# Altium schematic sheet Jukebox.SchDoc
size B
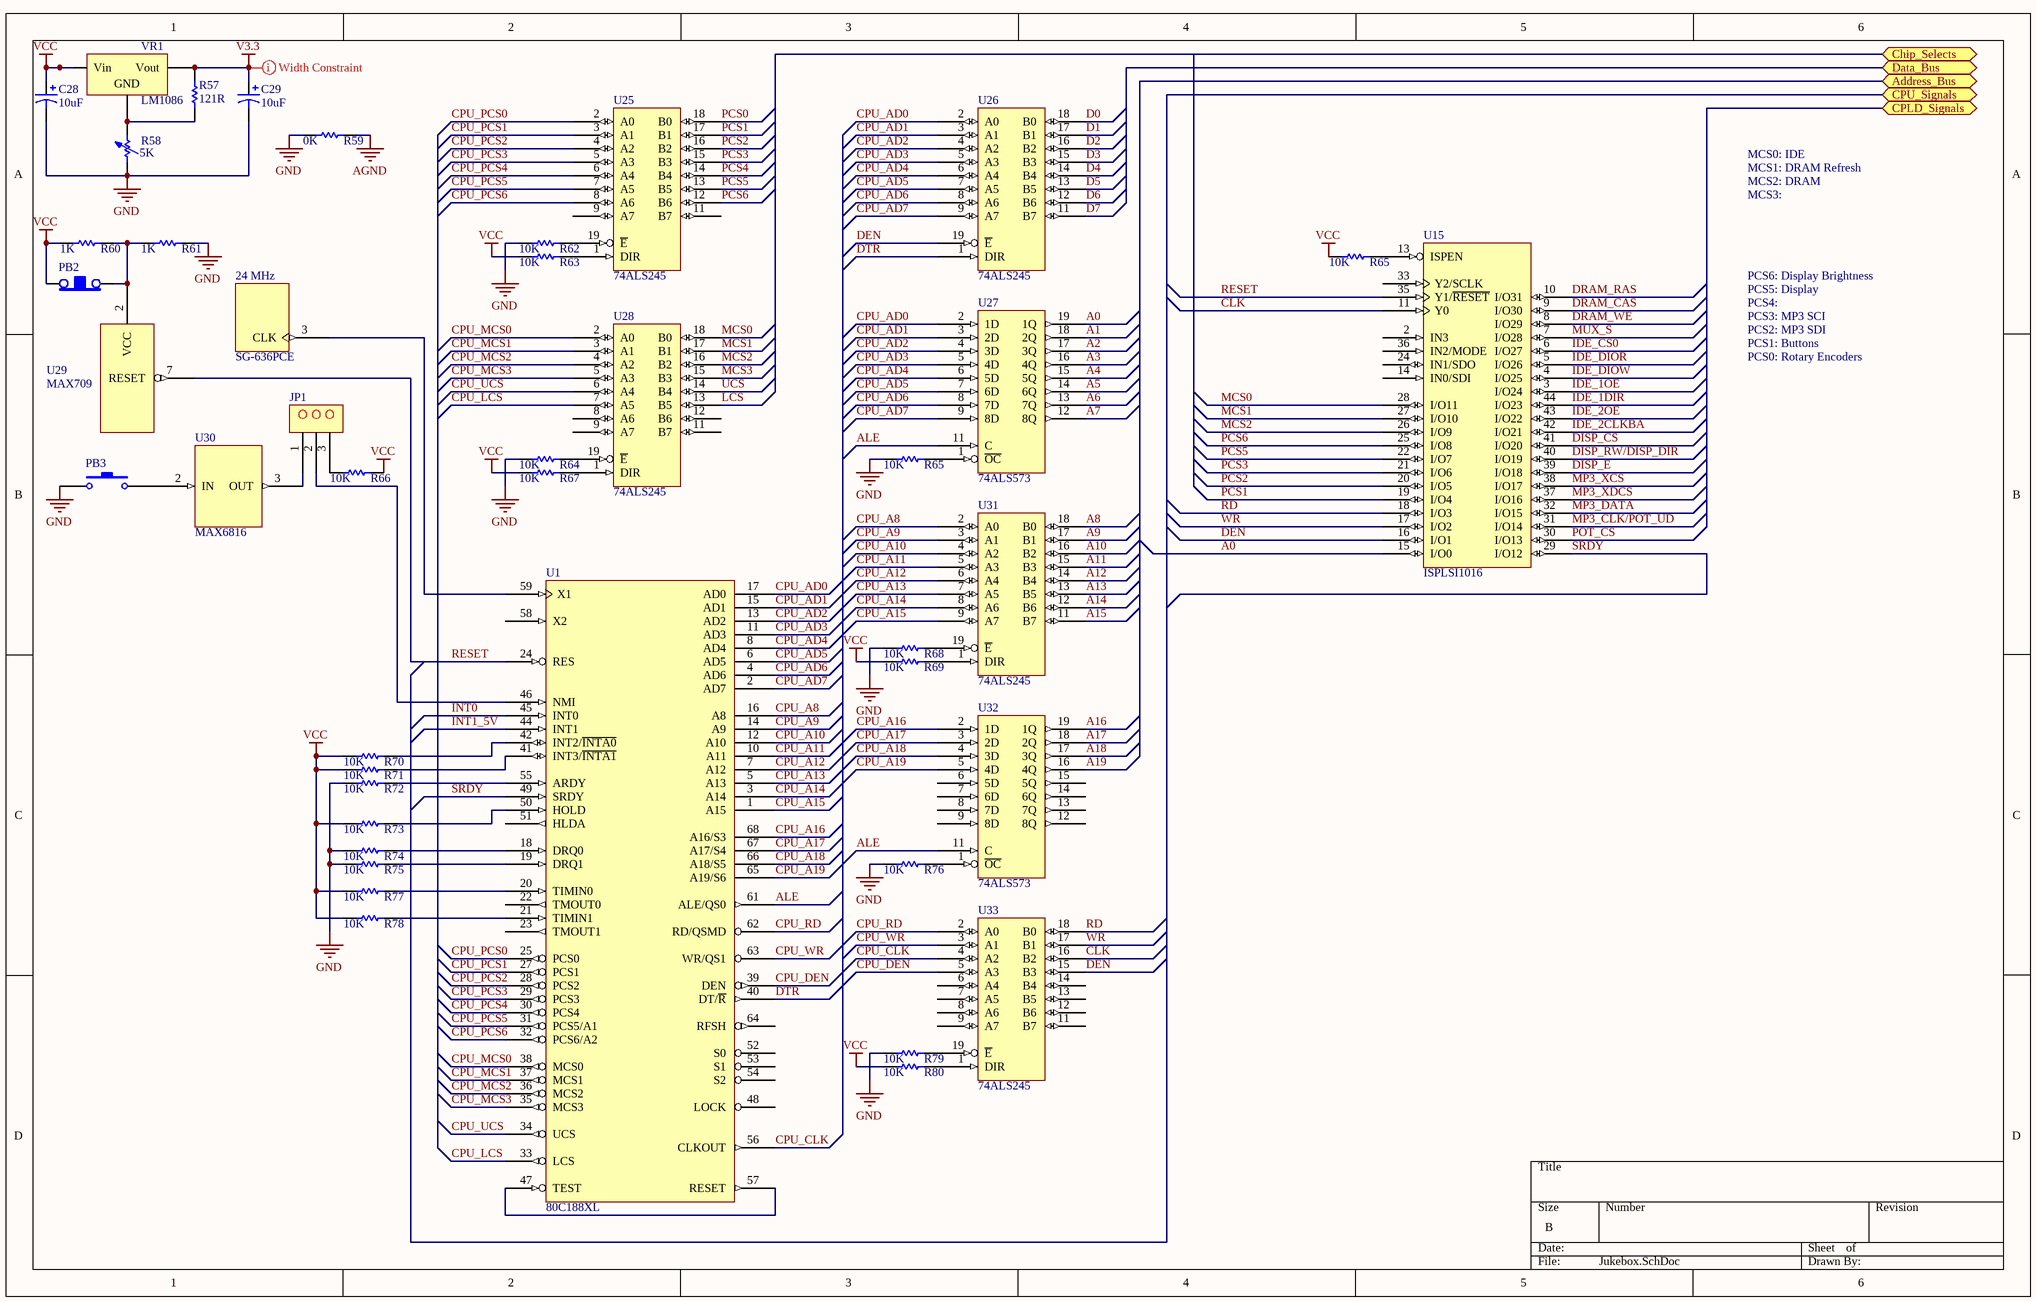
[diagram p0: Jukebox.SchDoc]

## Parts
(Parts that share a designator on the sheet are numbered #1, #2 ... from top to bottom, then left to right.)
24_MHz  SG-636PCE  [SG636PCE]
C28  value 10uF  [C0805]  (hidden comment: Cap Pol3)
C29  value 10uF  [C0805]  (hidden comment: Cap Pol3)
JP1  3P_JP  [3P_JP]  (value not drawn)
PB2  SWITCH-PBNC  [SIP2]  (value not drawn)
PB3  SW-PB  [PB_EG4791]  (value not drawn)
R57  value 121R  [AXIAL-0.3]  (hidden comment: Res1)
R58  value 5K  [AXIAL-0.7]  (hidden comment: Res Adj1)
R59  value 0K  [AXIAL-0.3]  (hidden comment: Res1)
R60  value 1K  [AXIAL-0.3]  (hidden comment: Res1)
R61  value 1K  [AXIAL-0.3]  (hidden comment: Res1)
R62  value 10K  [AXIAL-0.3]  (hidden comment: Res1)
R63  value 10K  [AXIAL-0.3]  (hidden comment: Res1)
R64  value 10K  [AXIAL-0.3]  (hidden comment: Res1)
R65#1  value 10K  [AXIAL-0.3]  (hidden comment: Res1)
R65#2  value 10K  [AXIAL-0.3]  (hidden comment: Res1)
R66  value 10K  [AXIAL-0.3]  (hidden comment: Res1)
R67  value 10K  [AXIAL-0.3]  (hidden comment: Res1)
R68  value 10K  [AXIAL-0.3]  (hidden comment: Res1)
R69  value 10K  [AXIAL-0.3]  (hidden comment: Res1)
R70  value 10K  [AXIAL-0.3]  (hidden comment: Res1)
R71  value 10K  [AXIAL-0.3]  (hidden comment: Res1)
R72  value 10K  [AXIAL-0.3]  (hidden comment: Res1)
R73  value 10K  [AXIAL-0.3]  (hidden comment: Res1)
R74  value 10K  [AXIAL-0.3]  (hidden comment: Res1)
R75  value 10K  [AXIAL-0.3]  (hidden comment: Res1)
R76  value 10K  [AXIAL-0.3]  (hidden comment: Res1)
R77  value 10K  [AXIAL-0.3]  (hidden comment: Res1)
R78  value 10K  [AXIAL-0.3]  (hidden comment: Res1)
R79  value 10K  [AXIAL-0.3]  (hidden comment: Res1)
R80  value 10K  [AXIAL-0.3]  (hidden comment: Res1)
U1  80C188XL  [PLCCS68I]
U15  ISPLSI1016  [TQFP44]
U25  74ALS245  [SSOP20]
U26  74ALS245  [SSOP20]
U27  74ALS573  [SSOP20]
U28  74ALS245  [SSOP20]
U29  MAX709  [UMAX8]
U30  MAX6816  [SOT-143]
U31  74ALS245  [SSOP20]
U32  74ALS573  [SSOP20]
U33  74ALS245  [SSOP20]
VR1  LM1086  [D2PAK_N]

## Ports
Address_Bus, Chip_Selects, CPLD_Signals, CPU_Signals, Data_Bus

## Nets
AGND: R59.1
GND: 24_MHz.2(GND) C28.2 C29.2 PB3.1 R58.1 R59.2 R61.1 R62.2 R64.2 R65#2.2 R68.2 R72.2 R74.2 R75.2 R76.2 R79.2 U1.26(GND) U1.60(GND) U15.1(GND) U15.23(GND) U25.10(GND) U26.10(GND) U27.10(GND) U28.10(GND) U29.3(GND) U30.1(GND) U31.10(GND) U32.10(GND) U33.10(GND)
V3.3: C29.1 R57.2 VR1.3(Vout)
VCC: 24_MHz.4(VCC) C28.1 PB2.1 R60.1 R63.2 R65#1.2 R66.1 R67.2 R69.2 R70.2 R71.2 R73.2 R77.2 R78.2 R80.2 U1.9(VCC) U1.43(VCC) U15.12(VCC) U15.34(VCC) U25.20(VCC) U26.20(VCC) U27.20(VCC) U28.20(VCC) U30.4(VCC) U31.20(VCC) U32.20(VCC) U33.20(VCC) VR1.1(Vin)
A0: U15.15(I/O0) U27.19(1Q)
A1: U27.18(2Q)
A2: U27.17(3Q)
A3: U27.16(4Q)
A4: U27.15(5Q)
A5: U27.14(6Q)
A6: U27.13(7Q)
A7: U27.12(8Q)
A8: U31.18(B0)
A9: U31.17(B1)
A10: U31.16(B2)
A11: U31.15(B3)
A12: U31.14(B4)
A13: U31.13(B5)
A14: U31.12(B6)
A15: U31.11(B7)
A16: U32.19(1Q)
A17: U32.18(2Q)
A18: U32.17(3Q)
A19: U32.16(4Q)
ALE: U1.61(ALE/QS0) U27.11(C) U32.11(C)
CLK: U15.11(Y0) U33.16(B2)
CPU_A8: U1.16(A8) U31.2(A0)
CPU_A9: U1.14(A9) U31.3(A1)
CPU_A10: U1.12(A10) U31.4(A2)
CPU_A11: U1.10(A11) U31.5(A3)
CPU_A12: U1.7(A12) U31.6(A4)
CPU_A13: U1.5(A13) U31.7(A5)
CPU_A14: U1.3(A14) U31.8(A6)
CPU_A15: U1.1(A15) U31.9(A7)
CPU_A16: U1.68(A16/S3) U32.2(1D)
CPU_A17: U1.67(A17/S4) U32.3(2D)
CPU_A18: U1.66(A18/S5) U32.4(3D)
CPU_A19: U1.65(A19/S6) U32.5(4D)
CPU_AD0: U1.17(AD0) U26.2(A0) U27.2(1D)
CPU_AD1: U1.15(AD1) U26.3(A1) U27.3(2D)
CPU_AD2: U1.13(AD2) U26.4(A2) U27.4(3D)
CPU_AD3: U1.11(AD3) U26.5(A3) U27.5(4D)
CPU_AD4: U1.8(AD4) U26.6(A4) U27.6(5D)
CPU_AD5: U1.6(AD5) U26.7(A5) U27.7(6D)
CPU_AD6: U1.4(AD6) U26.8(A6) U27.8(7D)
CPU_AD7: U1.2(AD7) U26.9(A7) U27.9(8D)
CPU_CLK: U1.56(CLKOUT) U33.4(A2)
CPU_DEN: U1.39(DEN) U33.5(A3)
CPU_LCS: U1.33(LCS) U28.7(A5)
CPU_MCS0: U1.38(MCS0) U28.2(A0)
CPU_MCS1: U1.37(MCS1) U28.3(A1)
CPU_MCS2: U1.36(MCS2) U28.4(A2)
CPU_MCS3: U1.35(MCS3) U28.5(A3)
CPU_PCS0: U1.25(PCS0) U25.2(A0)
CPU_PCS1: U1.27(PCS1) U25.3(A1)
CPU_PCS2: U1.28(PCS2) U25.4(A2)
CPU_PCS3: U1.29(PCS3) U25.5(A3)
CPU_PCS4: U1.30(PCS4) U25.6(A4)
CPU_PCS5: U1.31(PCS5/A1) U25.7(A5)
CPU_PCS6: U1.32(PCS6/A2) U25.8(A6)
CPU_RD: U1.62(RD/QSMD) U33.2(A0)
CPU_UCS: U1.34(UCS) U28.6(A4)
CPU_WR: U1.63(WR/QS1) U33.3(A1)
D0: U26.18(B0)
D1: U26.17(B1)
D2: U26.16(B2)
D3: U26.15(B3)
D4: U26.14(B4)
D5: U26.13(B5)
D6: U26.12(B6)
D7: U26.11(B7)
DEN: U15.16(I/O1) U26.19(~{E}) U33.15(B3)
DISP_CS: U15.41(I/O20)
DISP_E: U15.39(I/O18)
DISP_RW/DISP_DIR: U15.40(I/O19)
DRAM_CAS: U15.9(I/O30)
DRAM_RAS: U15.10(I/O31)
DRAM_WE: U15.8(I/O29)
DTR: U1.40(DT/~{R}) U26.1(DIR)
IDE_1DIR: U15.44(I/O23)
IDE_1OE: U15.3(I/O24)
IDE_2CLKBA: U15.42(I/O21)
IDE_2OE: U15.43(I/O22)
IDE_CS0: U15.6(I/O27)
IDE_DIOR: U15.5(I/O26)
IDE_DIOW: U15.4(I/O25)
INT0: U1.45(INT0)
INT1_5V: U1.44(INT1)
LCS: U28.13(B5)
MCS0: U15.28(I/O11) U28.18(B0)
MCS1: U15.27(I/O10) U28.17(B1)
MCS2: U15.26(I/O9) U28.16(B2)
MCS3: U28.15(B3)
MP3_CLK/POT_UD: U15.31(I/O14)
MP3_DATA: U15.32(I/O15)
MP3_XCS: U15.38(I/O17)
MP3_XDCS: U15.37(I/O16)
MUX_S: U15.7(I/O28)
PCS0: U25.18(B0)
PCS1: U15.19(I/O4) U25.17(B1)
PCS2: U15.20(I/O5) U25.16(B2)
PCS3: U15.21(I/O6) U25.15(B3)
PCS4: U25.14(B4)
PCS5: U15.22(I/O7) U25.13(B5)
PCS6: U15.25(I/O8) U25.12(B6)
POT_CS: U15.30(I/O13)
RD: U15.18(I/O3) U33.18(B0)
RESET: U1.24(RES) U15.35(Y1/~{RESET}) U29.7(RESET)
SRDY: U1.49(SRDY) U15.29(I/O12)
UCS: U28.14(B4)
WR: U15.17(I/O2) U33.17(B1)
Net24_MHz_3: 24_MHz.3(CLK) U1.59(X1)
NetJP1_1: JP1.1 U30.3(OUT)
NetJP1_2: JP1.2 U1.46(NMI)
NetJP1_3: JP1.3 R66.2
NetPB2_2: PB2.2 R60.2 R61.2 U29.2(VCC)
NetPB3_2: PB3.2 U30.2(IN)
NetR57_1: R57.1 R58.2 VR1.2(GND)
NetR62_1: R62.1 U25.19(~{E})
NetR63_1: R63.1 U25.1(DIR)
NetR64_1: R64.1 U28.19(~{E})
NetR65#1_1: R65#1.1 U15.13(ISPEN)
NetR65#2_1: R65#2.1 U27.1(~{OC})
NetR67_1: R67.1 U28.1(DIR)
NetR68_1: R68.1 U31.19(~{E})
NetR69_1: R69.1 U31.1(DIR)
NetR70_1: R70.1 U1.42(INT2/~{INTA0})
NetR71_1: R71.1 U1.41(INT3/~{INTA1})
NetR72_1: R72.1 U1.55(ARDY)
NetR73_1: R73.1 U1.50(HOLD)
NetR74_1: R74.1 U1.18(DRQ0)
NetR75_1: R75.1 U1.19(DRQ1)
NetR76_1: R76.1 U32.1(~{OC})
NetR77_1: R77.1 U1.20(TIMIN0)
NetR78_1: R78.1 U1.21(TIMIN1)
NetR79_1: R79.1 U33.19(~{E})
NetR80_1: R80.1 U33.1(DIR)
NetU1_47: U1.47(TEST) U1.57(RESET)

Not connected (* = marked no-connect by the designer): U1 22(TMOUT0) 23(TMOUT1) 48(LOCK) 51(HLDA) 52(S0) 53(S1) 54(S2) 58(X2) 64(RFSH); U15 2(IN3) 14(IN0/SDI) 24(IN1/SDO) 33(Y2/SCLK) 36(IN2/MODE); U25 9(A7) 11(B7); U28 8(A6) 9(A7) 11(B7) 12(B6); U32 6(5D) 7(6D) 8(7D) 9(8D) 12(8Q) 13(7Q) 14(6Q) 15(5Q); U33 6(A4) 7(A5) 8(A6) 9(A7) 11(B7) 12(B6) 13(B5) 14(B4)

## Layout directives
rule Width Constraint [Pref Width = 30mil    Min Width = 8mil    Max Width = 30mil]: V3.3

## Notes on the sheet
- MCS0: IDE
- MCS1: DRAM Refresh
- MCS3:
- MCS2: DRAM
- PCS6: Display Brightness
- PCS5: Display
- PCS4:
- PCS1: Buttons
- PCS0: Rotary Encoders
- PCS2: MP3 SDI
- PCS3: MP3 SCI

## Library data of the parts
24_MHz = OSC: TTL/CMOS Oscillator
C28 C29 = Cap Pol3: Polarized Capacitor (Surface Mount); Published: 8-Jun-2000; LatestRevisionDate: 29-May-2009; LatestRevisionNote: IPC-7351 Footprint Added.; PackageReference: C0805; Publisher: Altium Limited; PackageDescription: Chip Capacitor
PB2 = SWITCH-PBNC: Normally Closed Pushbutton Switch
PB3 = SW-PB: Switch; Published: 24-Mar-1999; LatestRevisionDate: 17-Jul-2002; LatestRevisionNote: Re-released for DXP Platform.; PackageReference: SPST-2; Publisher: Altium Limited; PackageDescription: Switch; 2 Leads
R57 R59-R64 R65#1 R65#2 R66-R80 = Res1: Resistor; Published: 8-Jun-2000; LatestRevisionDate: 17-Jul-2002; LatestRevisionNote: Re-released for DXP Platform.; PackageReference: AXIAL-0.3; Publisher: Altium Limited; PackageDescription: Axial Device, Thru-Hole; 2 Leads; 0.3 in Pin Spacing
R58 = Res Adj1: Variable Resistor; Set Position: 0.5; Published: 8-Jun-2000; LatestRevisionDate: 17-Jul-2002; LatestRevisionNote: Re-released for DXP Platform.; PackageReference: AXIAL-0.7; Publisher: Altium Limited; PackageDescription: Axial Device, Thru-Hole; 2 Leads; 0.7 in Pin Spacing
U1 = 80C188XL: Intel 80188 Microprocessor
U15 = ISPLSI1016: In-System Programmable High Density CPLD
U25 U26 U28 U31 U33 = 74ALS245: Octal Bus Transceiver
U27 U32 = 74ALS573: Octal Transparent Latch
U29 = MAX709: Maxim Power-On Reset
U30 = MAX6816: Single Switch Debouncer
VR1 = Volt Reg: Voltage Regulator; Published: 24-Mar-1999; LatestRevisionDate: 29-May-2009; LatestRevisionNote: IPC-7351 Footprint Added.; PackageReference: D2PAK; Publisher: Altium Limited; PackageDescription: 3-Pin Transistor Outline Package 2.54 mm Pitch, 15.1 mm Lead Span